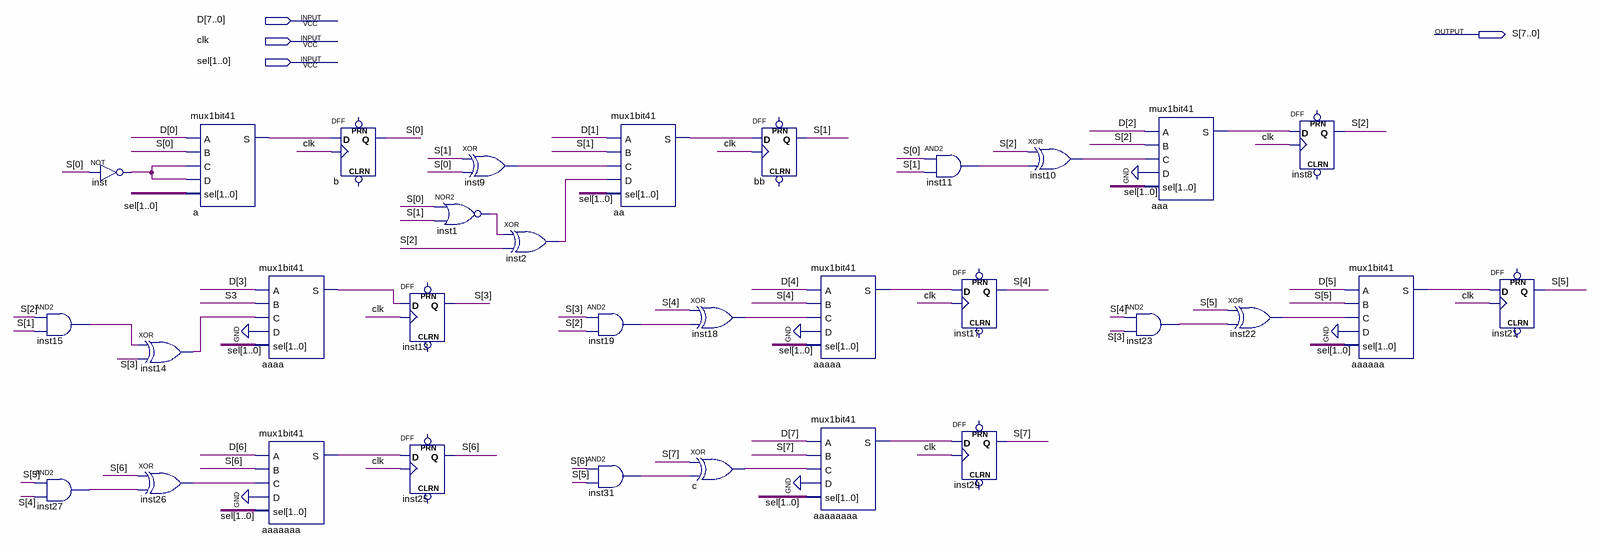
[diagram p0: schematic sheet]
// Quartus schematic CONTADOR.bdf as structural Verilog: 32 symbols, 4 pins
module CONTADOR (
  input  [7:0] D,
  input  clk,
  input  [1:0] sel,
  output [7:0] S
);

  wire a_s, aa_s, aaa_s, aaaa_s, aaaaa_s, aaaaaa_s, aaaaaaa_s, aaaaaaaa_s, c_out, inst1_out, inst2_out,
       inst9_out, inst10_out, inst11_out, inst14_out, inst15_out, inst18_out, inst19_out, inst22_out,
       inst23_out, inst26_out, inst27_out, inst31_out, inst_out;

  and inst15 (inst15_out, S[2], S[1]);
  and inst27 (inst27_out, S[5], S[4]);
  not inst (inst_out, S[0]);
  xor inst14 (inst14_out, inst15_out, S[3]);
  xor inst26 (inst26_out, S[6], inst27_out);
  mux1bit41 a (.A(D[0]), .B(S[0]), .C(inst_out), .D(inst_out), .sel(sel), .S(a_s));
  mux1bit41 aaaa (.A(D[3]), .B(S[3]), .C(inst14_out), .D(1'b0), .sel(sel), .S(aaaa_s));
  mux1bit41 aaaaaaa (.A(D[6]), .B(S[6]), .C(inst26_out), .D(1'b0), .sel(sel), .S(aaaaaaa_s));
  DFF b (.CLK(clk), .D(a_s), .Q(S[0]));  // open: CLRN, PRN
  DFF inst13 (.CLK(clk), .D(aaaa_s), .Q(S[3]));  // open: CLRN, PRN
  DFF inst25 (.CLK(clk), .D(aaaaaaa_s), .Q(S[6]));  // open: CLRN, PRN
  nor inst1 (inst1_out, S[0], S[1]);
  xor inst9 (inst9_out, S[1], S[0]);
  xor inst2 (inst2_out, inst1_out, S[2]);
  mux1bit41 aa (.A(D[1]), .B(S[1]), .C(inst9_out), .D(inst2_out), .sel(sel), .S(aa_s));
  and inst19 (inst19_out, S[3], S[2]);
  and inst31 (inst31_out, S[6], S[5]);
  xor inst18 (inst18_out, S[4], inst19_out);
  xor c (c_out, S[7], inst31_out);
  DFF bb (.CLK(clk), .D(aa_s), .Q(S[1]));  // open: CLRN, PRN
  mux1bit41 aaaaa (.A(D[4]), .B(S[4]), .C(inst18_out), .D(1'b0), .sel(sel), .S(aaaaa_s));
  mux1bit41 aaaaaaaa (.A(D[7]), .B(S[7]), .C(c_out), .D(1'b0), .sel(sel), .S(aaaaaaaa_s));
  and inst11 (inst11_out, S[0], S[1]);
  DFF inst17 (.CLK(clk), .D(aaaaa_s), .Q(S[4]));  // open: CLRN, PRN
  DFF inst29 (.CLK(clk), .D(aaaaaaaa_s), .Q(S[7]));  // open: CLRN, PRN
  xor inst10 (inst10_out, S[2], inst11_out);
  mux1bit41 aaa (.A(D[2]), .B(S[2]), .C(inst10_out), .D(1'b0), .sel(sel), .S(aaa_s));
  and inst23 (inst23_out, S[4], S[3]);
  xor inst22 (inst22_out, S[5], inst23_out);
  DFF inst8 (.CLK(clk), .D(aaa_s), .Q(S[2]));  // open: CLRN, PRN
  mux1bit41 aaaaaa (.A(D[5]), .B(S[5]), .C(inst22_out), .D(1'b0), .sel(sel), .S(aaaaaa_s));
  DFF inst21 (.CLK(clk), .D(aaaaaa_s), .Q(S[5]));  // open: CLRN, PRN
endmodule
